# EAGLE design PCB2 (EAGLE 9.3.0)
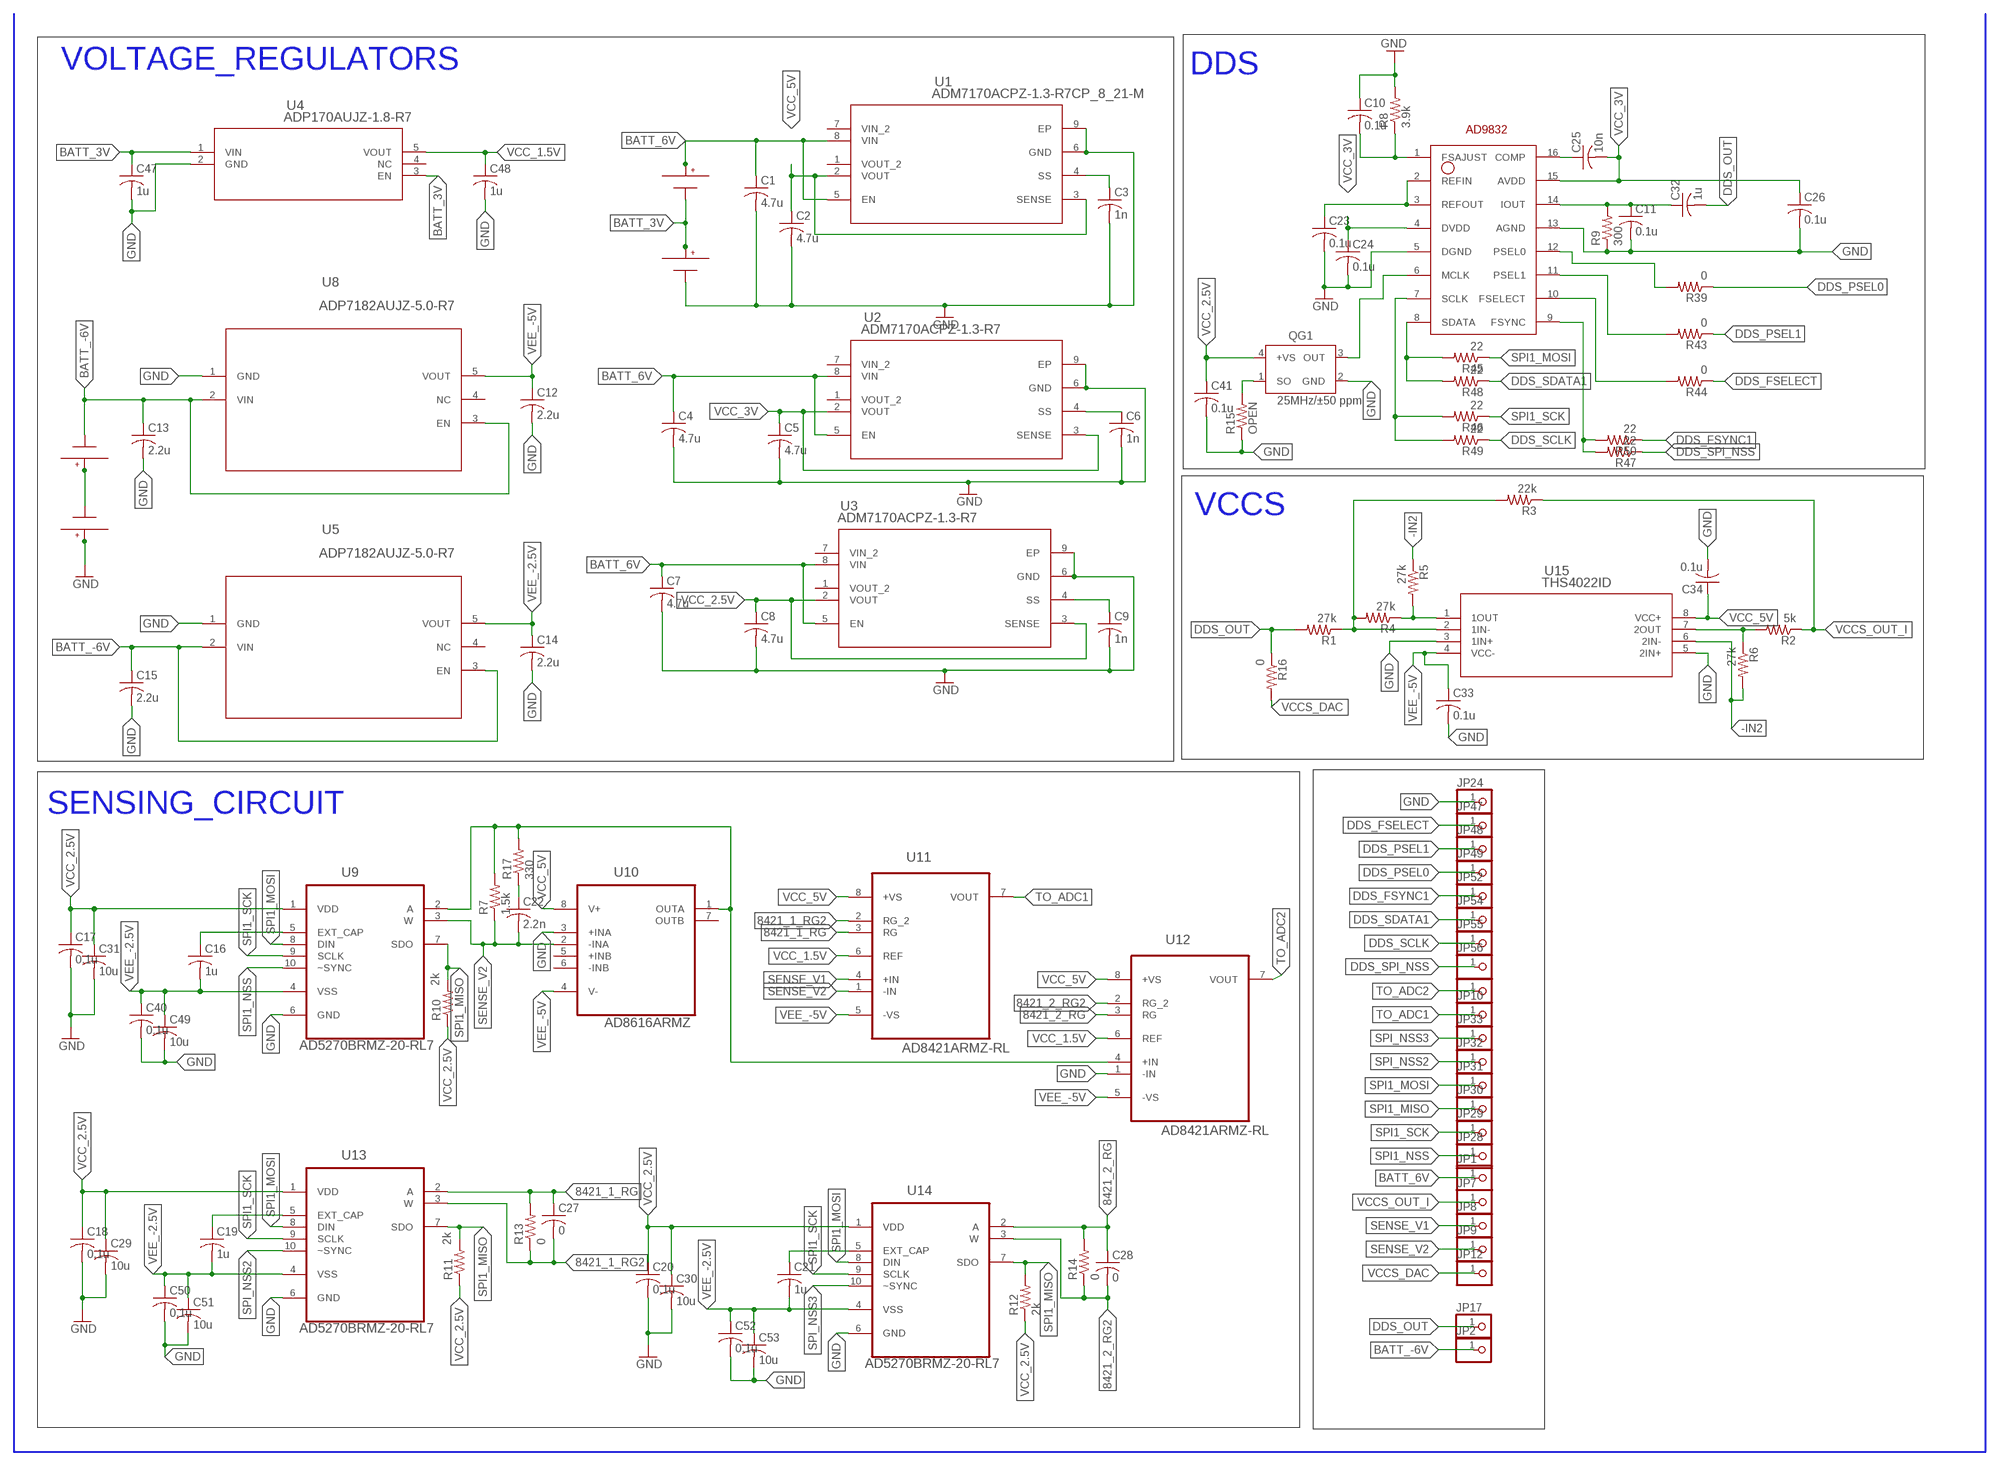
[diagram p0: schematic, sheet 1]

## Parts
C1  4.7u  C-USC0603  [C0603]
C2  4.7u  C-USC0603  [C0603]
C3  1n  C-USC0603  [C0603]
C4  4.7u  C-USC0603  [C0603]
C5  4.7u  C-USC0603  [C0603]
C6  1n  C-USC0603  [C0603]
C7  4.7u  C-USC0603  [C0603]
C8  4.7u  C-USC0603  [C0603]
C9  1n  C-USC0603  [C0603]
C10  0.1u  C-USC0603  [C0603]
C11  0.1u  C-USC0603  [C0603]
C12  2.2u  C-USC0603  [C0603]
C13  2.2u  C-USC0603  [C0603]
C14  2.2u  C-USC0603  [C0603]
C15  2.2u  C-USC0603  [C0603]
C16  1u  C-USC0603  [C0603]
C17  0.1u  C-USC0603  [C0603]
C18  0.1u  C-USC0603  [C0603]
C19  1u  C-USC0603  [C0603]
C20  0.1u  C-USC0603  [C0603]
C21  1u  C-USC0603  [C0603]
C22  2.2n  C-USC0603  [C0603]
C23  0.1u  C-USC0603  [C0603]
C24  0.1u  C-USC0603  [C0603]
C25  10n  C-USC0603  [C0603]
C26  0.1u  C-USC0603  [C0603]
C27  0  C-USC0603  [C0603]
C28  0  C-USC0603  [C0603]
C29  10u  C-USC0603  [C0603]
C30  10u  C-USC0603  [C0603]
C31  10u  C-USC0603  [C0603]
C32  1u  C-USC0603  [C0603]
C33  0.1u  C-USC0603  [C0603]
C34  0.1u  C-USC0603  [C0603]
C40  0.1u  C-USC0603  [C0603]
C41  0.1u  C-USC0603  [C0603]
C47  1u  C-USC0603  [C0603]
C48  1u  C-USC0603  [C0603]
C49  10u  C-USC0603  [C0603]
C50  0.1u  C-USC0603  [C0603]
C51  10u  C-USC0603  [C0603]
C52  0.1u  C-USC0603  [C0603]
C53  10u  C-USC0603  [C0603]
JP1  PINHD-1X1  [1X01]
JP2  PINHD-1X1  [1X01]
JP7  PINHD-1X1  [1X01]
JP8  PINHD-1X1  [1X01]
JP9  PINHD-1X1  [1X01]
JP10  PINHD-1X1  [1X01]
JP11  PINHD-1X1  [1X01]
JP12  PINHD-1X1  [1X01]
JP17  PINHD-1X1  [1X01]
JP24  PINHD-1X1  [1X01]
JP28  PINHD-1X1  [1X01]
JP29  PINHD-1X1  [1X01]
JP30  PINHD-1X1  [1X01]
JP31  PINHD-1X1  [1X01]
JP32  PINHD-1X1  [1X01]
JP33  PINHD-1X1  [1X01]
JP47  PINHD-1X1  [1X01]
JP48  PINHD-1X1  [1X01]
JP49  PINHD-1X1  [1X01]
JP52  PINHD-1X1  [1X01]
JP54  PINHD-1X1  [1X01]
JP55  PINHD-1X1  [1X01]
JP56  PINHD-1X1  [1X01]
QG1  25MHz/±50 ppm  WE-SPXO_IQXO-542_831056218  [WE-SPXO_IQXO-542]
R1  27k  R-US_R0603  [R0603]
R2  5k  R-US_R0603  [R0603]
R3  22k  R-US_R0603  [R0603]
R4  27k  R-US_R0603  [R0603]
R5  27k  R-US_R0603  [R0603]
R6  27k  R-US_R0603  [R0603]
R7  1.5k  R-US_R0603  [R0603]
R8  3.9k  R-US_R0603  [R0603]
R9  300  R-US_R0603  [R0603]
R10  2k  R-US_R0603  [R0603]
R11  2k  R-US_R0603  [R0603]
R12  2k  R-US_R0603  [R0603]
R13  0  R-US_R0603  [R0603]
R14  0  R-US_R0603  [R0603]
R15  OPEN  R-US_R0603  [R0603]
R16  0  R-US_R0603  [R0603]
R17  330  R-US_R0603  [R0603]
R39  0  R-US_R0603  [R0603]
R43  0  R-US_R0603  [R0603]
R44  0  R-US_R0603  [R0603]
R45  22  R-US_R0603  [R0603]
R46  22  R-US_R0603  [R0603]
R47  22  R-US_R0603  [R0603]
R48  22  R-US_R0603  [R0603]
R49  22  R-US_R0603  [R0603]
R50  22  R-US_R0603  [R0603]
U1  ADM7170ACPZ-1.3-R7CP_8_21-M  [CP_8_21-M]
U2  ADM7170ACPZ-1.3-R7  [CP_8_21]
U3  ADM7170ACPZ-1.3-R7  [CP_8_21]
U4  ADP170AUJZ-1.8-R7  [UJ_5]
U5  ADP7182AUJZ-5.0-R7  [UJ_5]
U8  ADP7182AUJZ-5.0-R7  [UJ_5]
U9  AD5270BRMZ-20-RL7  [SOP50P490X110-10N]
U10  AD8616ARMZ  [SOP65P490X110-8N]
U11  AD8421ARMZ-RL  [SOP65P490X110-8N]
U12  AD8421ARMZ-RL  [SOP65P490X110-8N]
U13  AD5270BRMZ-20-RL7  [SOP50P490X110-10N]
U14  AD5270BRMZ-20-RL7  [SOP50P490X110-10N]
U15  THS4022ID  [D8]
U$1  AD9832  [TSSOP16]
U$2  BAT-HLD-001  [BAT-HLD-001]
U$3  BAT-HLD-001  [BAT-HLD-001]
U$4  BAT-HLD-001  [BAT-HLD-001]
U$5  BAT-HLD-001  [BAT-HLD-001]

## Nets
8421_1_RG: C27.1 R13.2 U11.3(RG) U13.2(A)
8421_1_RG2: C27.2 R13.1 U11.2(RG_2) U13.3(W)
8421_2_RG: C28.1 R14.2 U12.3(RG) U14.2(A)
8421_2_RG2: C28.2 R14.1 U12.2(RG_2) U14.3(W)
-IN2: R5.1 R6.2 U15.6(2IN-)
BATT_3V: C47.1 U4.1(VIN) U4.3(EN) U$2.- U$3.+@1(+) U$3.+@2(+)
BATT_6V: C1.1 C4.1 C7.1 JP1.1 U1.5(EN) U1.8(VIN) U2.5(EN) U2.8(VIN) U3.5(EN) U3.8(VIN) U$2.+@1(+) U$2.+@2(+)
BATT_-6V: C13.1 C15.1 JP2.1 U5.2(VIN) U5.3(EN) U8.2(VIN) U8.3(EN) U$4.-
DDS_FSELECT: JP47.1 R44.1
DDS_FSYNC1: JP52.1 R50.1
DDS_OUT: C32.2 JP17.1 R1.2 R16.1
DDS_PSEL0: JP49.1 R39.1
DDS_PSEL1: JP48.1 R43.1
DDS_SCLK: JP55.1 R49.1
DDS_SDATA1: JP54.1 R48.1
DDS_SPI_NSS: JP56.1 R47.1
GND: C1.2 C2.2 C3.2 C4.2 C5.2 C6.2 C7.2 C8.2 C9.2 C10.1 C11.2 C12.2 C13.2 C14.2 C15.2 C17.2 C18.2 C20.2 C23.2 C24.2 C26.2 C29.2 C30.2 C31.2 C33.2 C34.2 C40.2 C41.2 C47.2 C48.2 C49.2 C50.2 C51.2 C52.2 C53.2 JP24.1 QG1.2(GND) R8.2 R9.1 R15.1 U1.6(GND) U1.9(EP) U2.6(GND) U2.9(EP) U3.6(GND) U3.9(EP) U4.2(GND) U5.1(GND) U8.1(GND) U9.6(GND) U10.3(+INA) U12.1(-IN) U13.6(GND) U14.6(GND) U15.3(1IN+) U15.5(2IN+) U$1.5(DGND) U$1.13(AGND) U$3.- U$5.+@1(+) U$5.+@2(+)
N$1: C11.1 C32.1 R9.2 U$1.14(IOUT)
N$2: C6.1 U2.4(SS)
N$3: R47.2 R50.2 U$1.9(FSYNC)
N$4: C3.1 U1.4(SS)
N$5: C22.1 R17.1
N$6: C16.1 U9.5(EXT_CAP)
N$7: R7.2 R17.2 U9.2(A) U10.1(OUTA) U12.4(+IN)
N$9: C9.1 U3.4(SS)
N$11: U$4.+@1(+) U$4.+@2(+) U$5.-
N$12: R45.2 R48.2 U$1.8(SDATA)
N$13: C19.1 U13.5(EXT_CAP)
N$14: C10.2 R8.1 U$1.1(FSAJUST)
N$15: C25.1 U$1.16(COMP)
N$16: C21.1 U14.5(EXT_CAP)
N$17: C23.1 U$1.2(REFIN) U$1.3(REFOUT)
N$18: QG1.1(SO) R15.2
N$19: R46.2 R49.2 U$1.7(SCLK)
N$23: R2.2 R6.1 U15.7(2OUT)
N$25: QG1.3(OUT) U$1.6(MCLK)
N$26: R4.1 R5.2 U15.1(1OUT)
N$27: R1.1 R3.2 R4.2 U15.2(1IN-)
N$52: R44.2 U$1.10(FSELECT)
N$53: R43.2 U$1.11(PSEL1)
N$56: R39.2 U$1.12(PSEL0)
SENSE_V1: JP8.1 U11.4(+IN)
SENSE_V2: C22.2 JP9.1 R7.1 U9.3(W) U10.2(-INA) U11.1(-IN)
SPI1_MISO: JP30.1 R10.2 R11.2 R12.2 U9.7(SDO) U13.7(SDO) U14.7(SDO)
SPI1_MOSI: JP31.1 R45.1 U9.8(DIN) U13.8(DIN) U14.8(DIN)
SPI1_NSS: JP28.1 U9.10(~SYNC)
SPI1_SCK: JP29.1 R46.1 U9.9(SCLK) U13.9(SCLK) U14.9(SCLK)
SPI_NSS2: JP32.1 U13.10(~SYNC)
SPI_NSS3: JP33.1 U14.10(~SYNC)
TO_ADC1: JP10.1 U11.7(VOUT)
TO_ADC2: JP11.1 U12.7(VOUT)
VCC_1.5V: C48.1 U4.5(VOUT) U11.6(REF) U12.6(REF)
VCC_2.5V: C8.1 C17.1 C18.1 C20.1 C29.1 C30.1 C31.1 C41.1 QG1.4(+VS) R10.1 R11.1 R12.1 U3.2(VOUT) U3.3(SENSE) U9.1(VDD) U13.1(VDD) U14.1(VDD)
VCC_3V: C5.1 C24.1 C25.2 C26.1 U2.2(VOUT) U2.3(SENSE) U$1.4(DVDD) U$1.15(AVDD)
VCC_5V: C2.1 C34.1 U1.2(VOUT) U1.3(SENSE) U10.8(V+) U11.8(+VS) U12.8(+VS) U15.8(VCC+)
VCCS_DAC: JP12.1 R16.2
VCCS_OUT_I: JP7.1 R2.1 R3.1
VEE_-2.5V: C14.1 C16.2 C19.2 C21.2 C40.1 C49.1 C50.1 C51.1 C52.1 C53.1 U5.5(VOUT) U9.4(VSS) U13.4(VSS) U14.4(VSS)
VEE_-5V: C12.1 C33.1 U8.5(VOUT) U10.4(V-) U11.5(-VS) U12.5(-VS) U15.4(VCC-)
Unconnected: U1.1(VOUT_2) U1.7(VIN_2) U2.1(VOUT_2) U2.7(VIN_2) U3.1(VOUT_2) U3.7(VIN_2) U4.4(NC) U5.4(NC) U8.4(NC) U10.5(+INB) U10.6(-INB) U10.7(OUTB)

## Notes on the sheet
- VOLTAGE_REGULATORS | DDS
- VCCS
- SENSING_CIRCUIT

## Library data of the parts
C1-C34 C40 C41 C47-C53 = adafruit:C-US: CAPACITOR, American symbol
JP1 JP7-JP12 JP24 JP28-JP33 JP47-JP49 JP52 JP54-JP56 = adafruit:PINHD-1X1: Pin header 1x1 for 0.1" spacing With round pins
JP2 JP17 = adafruit:PINHD-1X1: Pin header 1x1 for 0.1" spacing With round pins; SPICEPREFIX: X
QG1 = Crystal25MHz:WE-SPXO_IQXO-542: WE-SPXO Simple Packaged Quartz Oscillator <https://katalog.we-online.com/media/images/v2/o135918v209%20Family_WE-SPXO.jpg> Details see: https://katalog.we-online.com/en/pbs/WE-SPXO Created by Yingchun Shan,2018-11-19 2018 (C) Wurth Elektronik; WE-NUMBER: 831056218
R1-R17 R39 R43-R50 = adafruit:R-US_: RESISTOR, American symbol
U1-U3 = ADM7170:ADM7170ACPZ-1.3-R7; MANUFACTURER_PART_NUMBER: ADM7170ACPZ1.3R7; VENDOR: Analog Devices Inc
U4 = ADP170:ADP170AUJZ-1.8-R7; MANUFACTURER_PART_NUMBER: ADP170AUJZ1.8R7; VENDOR: Analog Devices Inc
U5 U8 = ADP7182:ADP7182AUJZ-5.0-R7; MANUFACTURER_PART_NUMBER: ADP7182AUJZ5.0R7; VENDOR: Analog Devices Inc
U9 U13 U14 = AD5270BRMZ-20-RL7:AD5270BRMZ-20-RL7: Digital Rheostat; AVAILABILITY: Unavailable; DESCRIPTION: Digital Potentiometer 1024POS 20KOhm Single 10-Pin MSOP T/R; MF: Analog Devices; MP: AD5270BRMZ-20-RL7; PACKAGE: TFSOP-10 Analog Devices; PRICE: None
U10 = AD8616ARMZ:AD8616ARMZ: Input/Output Operational Amplifiers; AVAILABILITY: Unavailable; DESCRIPTION: IC, Operational Amplifier, DUAL, CMOS, TSSOP, 8PIN, PLASTIC; MF: Analog Devices; MP: AD8616ARMZ-REEL; PACKAGE: MSOP-8 Analog Devices; PRICE: None
U11 U12 = AD8421ARMZ-RL:AD8421ARMZ-RL: Instrumentation Amplifier; AVAILABILITY: Unavailable; DESCRIPTION: Amplifier - Special Purpose; MF: Analog Devices; MP: AD8421ARMZ-RL; PACKAGE: MSOP-8 Analog Devices; PRICE: None
U15 = THS4022:THS4022ID; MANUFACTURER_PART_NUMBER: THS4022ID; VENDOR: Texas Instruments
U$1 = AD9832:AD9832: The AD9832 is a numerically controlled oscillator employing a phase accumulator, a sine look-up table and a 10-bit D/A converter integrated on a single CMOS chip. Modulation capabilities are provided for phase modulation and frequency modulation. Clock rates up to 25 MHz are supported. Frequency accuracy can be controlled to one part in 4 billion. Modulation is effected by loading registers through the serial interface. A power-down bit allows the user to power down the AD9832 when it is not in use, the power consumption being reduced to 5 mW (5 V) or 3 mW (3 V). The part is available in a 16-lead TSSOP package.; AVAILABILITY: Unavailable; DESCRIPTION: ADI 10-BIT D/A CONVERTER ON A SINGL.CHIP IC.; MF: Analog Devices; MP: AD9832; PACKAGE: None; PRICE: None
U$2-U$5 = BAT-HLD-001:BAT-HLD-001: Linx Technologies BAT-HLD-001 surface mount CR2032 single-cell holder digikey: BAT-HLD-001-ND; AVAILABILITY: Unavailable; DESCRIPTION: CR2032 Phosphor Bronze / Nickel Plated 20 mm Cell Size Battery Holder; MF: Linx Technologies; MP: BAT-HLD-001; PACKAGE: None; PRICE: None

## Net classes
0 default: width 0.203 mm

## Board
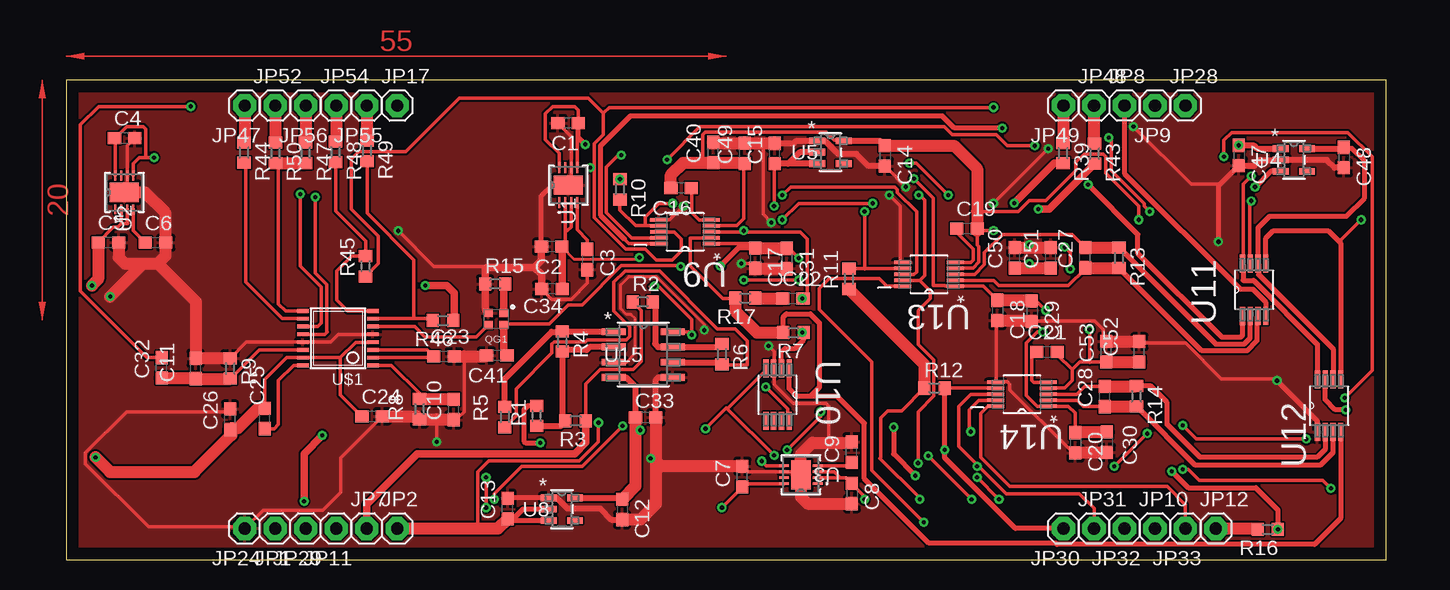
[diagram p1: board, top side]
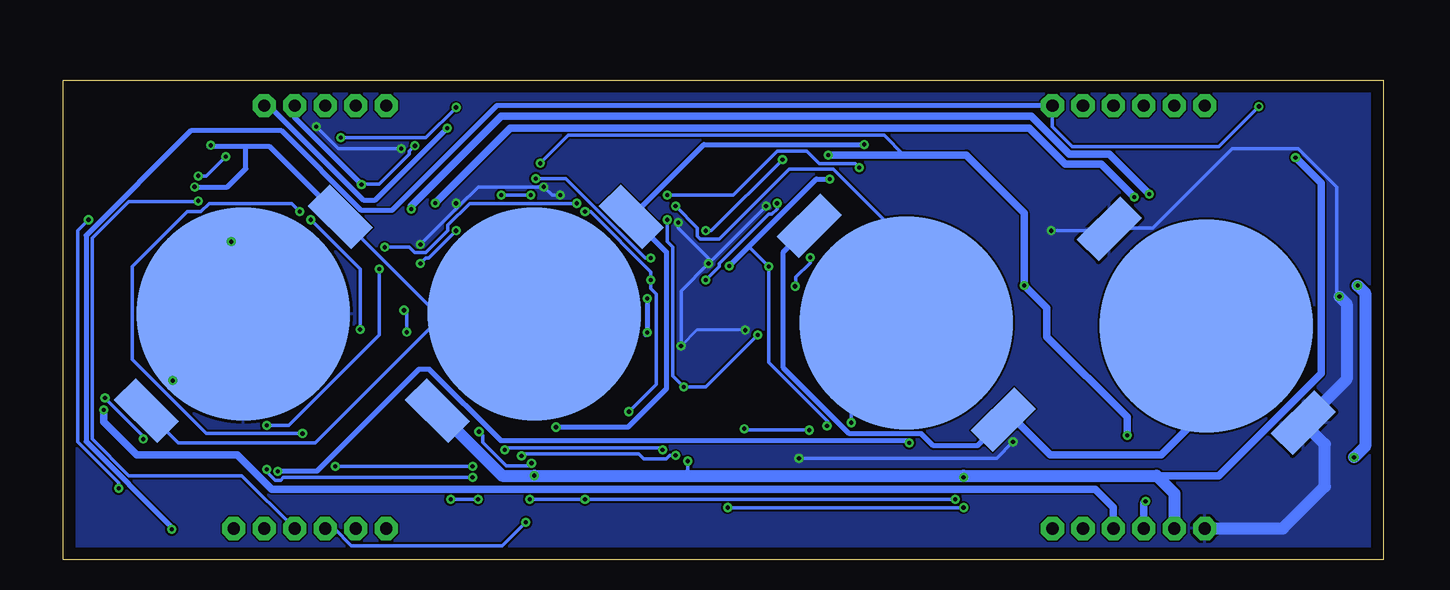
[diagram p2: board, bottom side, seen from below]

Size 110 x 40 mm. Coordinates in mm from the lower left corner, seen from the top.
Outline: 0,0 110,0 110,40 0,40 0,0
Copper layers (1*16): Top 0.035mm / dielectric 1.5mm / Bottom 0.035mm
Design rules "default": minimum track width 6mil, minimum drill 0.35mm, track to track 6mil, track to pad 6mil, pad to pad 6mil, via to via 6mil, smd to smd 6mil, copper to edge 40mil, drill to drill 6mil, minimum pad ring 10mil, minimum via ring 8mil, stop-mask expansion 4mil, vias tented up to drill 0mil, thermal gap 10mil

### Footprints (pad centres in the part's own frame; a part is rotated, then mirrored left to right if it is on the bottom)
C0603 = smd 1.1 x 1: 1 -0.85,0; 2 0.85,0
1X01 = drill 1.016 pad 1.93 octagon: 1 0,0
WE-SPXO_IQXO-542 = smd 0.75 x 0.65: 1 -0.65,-0.5; 2 0.65,-0.5; 3 0.65,0.5; 4 -0.65,0.5
R0603 = smd 1 x 1.1: 1 -0.85,0; 2 0.85,0
CP_8_21-M = smd 0.906 x 0.198: 1 -1.453,0.75; 2 -1.453,0.25; 3 -1.453,-0.25; 4 -1.453,-0.75; 5 1.453,-0.75; 6 1.453,-0.25; 7 1.453,0.25; 8 1.453,0.75 | smd 1.6 x 2.44: 9 0,0
CP_8_21 = smd 0.805 x 0.198: 1 -1.402,0.75; 2 -1.402,0.25; 3 -1.402,-0.25; 4 -1.402,-0.75; 5 1.402,-0.75; 6 1.402,-0.25; 7 1.402,0.25; 8 1.402,0.75 | smd 1.6 x 2.44: 9 0,0
UJ_5 = smd 1.321 x 0.559: 1 -1.092,0.95; 2 -1.092,0; 3 -1.092,-0.95; 4 1.092,-0.95; 5 1.092,0.95
SOP50P490X110-10N = smd 1.422 x 0.305: 1 -2.184,0.991; 2 -2.184,0.508; 3 -2.184,0; 4 -2.184,-0.508; 5 -2.184,-0.991; 6 2.184,-0.991; 7 2.184,-0.508; 8 2.184,0; 9 2.184,0.508; 10 2.184,0.991
SOP65P490X110-8N = smd 1.499 x 0.432: 1 -2.184,0.965; 2 -2.184,0.33; 3 -2.184,-0.33; 4 -2.184,-0.965; 5 2.184,-0.965; 6 2.184,-0.33; 7 2.184,0.33; 8 2.184,0.965
D8 = smd 1.981 x 0.559: 1 -2.464,1.905; 2 -2.464,0.635; 3 -2.464,-0.635; 4 -2.464,-1.905; 5 2.464,-1.905; 6 2.464,-0.635; 7 2.464,0.635; 8 2.464,1.905
TSSOP16 = smd 0.305 x 0.991: 1 -2.275,-2.918; 2 -1.625,-2.918; 3 -0.975,-2.918; 4 -0.325,-2.918; 5 0.325,-2.918; 6 0.975,-2.918; 7 1.625,-2.918; 8 2.275,-2.918; 9 2.275,2.918; 10 1.625,2.918; 11 0.975,2.918; 12 0.325,2.918; 13 -0.325,2.918; 14 -0.975,2.918; 15 -1.625,2.918; 16 -2.275,2.918
BAT-HLD-001 = smd 2.54 x 5.08: +@1 -11.43,0; +@2 11.43,0 | smd 17.78 x 17.78: - 0,0

### Placement (x,y rotation side)
C1  41.82,36.41 180 top
C2  40.45,26.1 180 top
C3  43.43,25.03 270 top
C4  4.86,35.17 0 top
C5  3.51,26.46 0 top
C6  7.43,26.43 0 top
C7  56.35,6.93 90 top
C8  65.47,5.53 270 top
C9  65.44,8.97 90 top
C10  32.28,12.52 90 top
C11  10.79,15.94 90 top
C12  46.32,4.19 270 top
C13  36.78,4.27 90 top
C14  68.22,33.67 270 top
C15  59.03,33.87 90 top
C16  51.24,30.99 180 top
C17  57.41,25.14 270 top
C18  77.59,20.79 270 top
C19  75.06,27.62 0 top
C20  84.09,9.74 270 top
C21  81.72,17.34 0 top
C22  60.55,21.79 0 top
C23  31.47,16.96 0 top
C24  25.49,11.96 0 top
C25  16.54,11.77 90 top
C26  13.65,11.71 90 top
C27  84.9,25.19 90 top
C28  86.54,13.61 90 top
C29  80.46,20.72 270 top
C30  86.71,9.8 270 top
C31  60.04,25.11 270 top
C32  7.94,15.99 90 top
C33  48.28,11.88 0 top
C34  40.47,22.57 180 top
C40  53.91,33.95 90 top
C41  35.88,17.04 180 top
C47  97.71,33.71 270 top
C48  106.46,33.54 270 top
C49  56.54,33.88 90 top
C50  79.04,25.17 90 top
C51  82.04,25.18 90 top
C52  89.42,17.34 90 top
C53  86.67,17.34 90 top
JP1  17.41,2.6 180 top
JP2  27.57,2.6 0 top
JP7  25.03,2.6 0 top
JP8  88.18,37.88 0 top
JP9  90.72,37.88 180 top
JP10  90.72,2.6 0 top
JP11  22.49,2.6 180 top
JP12  95.8,2.6 0 top
JP17  27.57,37.88 0 top
JP24  14.87,2.6 180 top
JP28  93.26,37.88 0 top
JP29  19.95,2.6 180 top
JP30  83.1,2.6 180 top
JP31  85.64,2.6 0 top
JP32  88.18,2.6 180 top
JP33  93.26,2.6 180 top
JP47  14.87,37.88 180 top
JP48  85.64,37.88 0 top
JP49  83.1,37.88 180 top
JP52  17.41,37.88 0 top
JP54  22.49,37.88 0 top
JP55  25.03,37.88 180 top
JP56  19.95,37.88 180 top
QG1  35.81,20.08 180 top
R1  39.2,11.99 90 top
R2  48.04,21.5 0 top
R3  42.45,11.58 180 top
R4  41.33,18.2 270 top
R5  36.54,11.9 90 top
R6  54.64,17.14 270 top
R7  60.6,18.94 180 top
R8  29.43,12.55 270 top
R9  13.66,15.95 270 top
R10  46.13,30.89 270 top
R11  65.22,23.43 90 top
R12  72.34,14.31 0 top
R13  87.73,25.18 270 top
R14  89.19,13.62 270 top
R15  35.75,23 0 top
R16  100.12,2.52 180 top
R17  56.58,21.82 180 top
R39  83.06,33.91 270 top
R43  85.69,33.87 270 top
R44  14.81,33.95 270 top
R45  24.94,24.48 90 top
R46  31.39,19.94 180 top
R47  19.93,33.94 270 top
R48  22.43,34.02 270 top
R49  25.06,34.09 270 top
R50  17.43,33.92 270 top
U1  41.83,31.23 90 top
U2  4.83,30.63 90 top
U3  61.22,7.08 180 top
U4  102.3,33.34 0 top
U5  63.69,33.98 0 top
U8  41.3,4.21 0 top
U9  51.57,27.34 180 top
U10  59.27,13.75 270 top
U11  98.98,22.51 90 top
U12  105.23,12.84 90 top
U13  71.89,23.8 180 top
U14  79.64,13.8 180 top
U15  48.08,17.1 0 top
U$1  22.64,18.47 90 top
U$2  70.75,20.5 45 bottom
U$3  95,20.5 45 bottom
U$4  39.75,19.75 315 bottom
U$5  14.75,19.5 315 bottom

### Tracks (layer width: path | path; a pad name or v marks a point on that pad's centre or on a via)
8421_1_RG
  Top 0.305: U13.2 77.29,23.29 77.72,22.86 83.52,22.86 84.9,24.25 C27.1
  Top 0.406: U11.3 99.22,20.24 99.22,18.27 98.38,17.42 94.64,17.42 87.72,24.34
  Top 1.016: C27.1 87.72,24.34 R13.2
8421_1_RG2
  Top 0.305: U13.3 75.69,23.8 76.5,24.61 76.5,25.6 78.03,27.13 83.82,27.13 C27.2
  Top 0.406: R13.1 95.78,17.98 98.15,17.98 98.65,18.49 U11.2
  Top 1.016: C27.2 87.72,26.04 R13.1
8421_2_RG
  Top 0.305: U14.2 84.24,13.29 84.76,12.78 86.56,12.78
  Top 0.406: R14.2 94.03,7.92 104.55,7.92 105.56,8.94 U12.3
  Top 1.016: C28.1 86.56,12.78 R14.2
8421_2_RG2
  Top 0.305: U14.3 84.21,13.8 84.87,14.46 C28.2
  Top 0.406: U12.2 104.9,9.19 104.24,8.53 94.49,8.53 91.75,11.28 91.75,13.11 90.38,14.47 R14.1
  Top 1.016: C28.2 89.17,14.46 R14.1
-IN2
  Top 0.305: R5.1 37.5,12.01 37.5,14.25 40.48,17.23 40.48,17.98 40.65,18.16 43.25,18.16 43.41,18.32 46.66,18.32 46.97,18.63 46.97,19.39 45.64,20.72 45.64,23.14 46.56,24.06 49.44,24.06 54.25,19.25 55.75,19.25 56.75,18.25 56.75,16.25 54.68,16.25 R6.2
  Top 0.508: U15.6 54.47,16.46 R6.2
BATT_3V  (via drill 0.35)
  Top 0.406: U4.3 100.36,32.39 v99.06,31.09
  Top 0.508: C47.1 98.94,34.56 99.21,34.29 U4.1
  Bottom 0.305: U$3.+@2 78.84,20.5 U$2.- 78.25,20.5 89,9.75 100.41,9.75 U$3.+@1
  Bottom 0.406: U$3.+@2 92.78,34.44 94.79,34.44 | 94.79,34.44 97.83,34.44 | 97.84,34.44 97.83,34.44 | 97.83,34.44 C47.1 | v99.06,31.09 96.32,31.09 94.79,32.61 94.79,34.44
  other vias: 97.71,34.56
BATT_6V  (via drill 0.35)
  Top 0.305: U2.8 4.08,35.1 C4.1 4.12,35.2 5.03,36.12 6.4,36.12 6.63,35.89 6.63,33.53 | U1.5 42.58,36.32 C1.1 42.67,37.49 42.37,37.8 40.54,37.8 39.93,37.19 39.93,35.05 41.08,33.9 U1.8 | U3.8 56.59,6.33 C7.1 56.24,5.94 v54.63,4.34 | v7.32,33.53 6.63,33.53 | 6.63,33.53 6.1,33.53 5.58,33.01 U2.5 | v34.98,4.34 v34.98,6.86 | U3.5 58.35,7.83 v57.96,8.22
  Top 0.406: v68.94,11.05 68.94,8.81 v70.75,7 v70.75,7.01 | v43.25,34.63 42.67,35.21 C1.1
  Bottom 0.305: v54.63,4.34 v34.98,4.34 | v34.98,6.86 34.98,7.01 | v57.96,8.22 57.96,7.07 58.02,7.01
  Bottom 0.406: v68.94,11.05 62.95,11.05 59.75,14.25 59.75,25.66 U$2.+@2 56.62,34.63 v43.25,34.63
  Bottom 0.61: 18.9,7.01 13.72,7.01 5.18,15.54 5.18,31.39 v7.32,33.53
  Bottom 1.016: U$2.+@1 73.42,7.01 v70.75,7.01 58.02,7.01 34.98,7.01 18.9,7.01 17.41,5.52 JP1.1
BATT_-6V  (via drill 0.35)
  Top 0.305: v58.98,29.49 58.98,32.92 C15.1 | 34.29,2.6 34.29,7.32 35.2,8.23 42.75,8.23 44.35,9.83 v44.35,11.43
  Top 0.406: U8.2 38.04,4.21 37.25,3.42 C13.1 36.94,3.26 U8.3
  Top 0.508: U5.2 61.11,33.98 60.16,33.03 | C15.1 60.15,33.02 60.16,33.03 | U5.3 60.16,33.03
  Top 1.016: JP2.1 34.29,2.6 35.96,2.6 C13.1
  Bottom 0.305: v58.98,29.49 57.15,27.66 57.15,26.98 56.92,26.75 55.32,26.75 49.49,32.58 45.84,32.58 39.78,26.52 39.78,19.89 U$4.- 39.78,19.66 44.35,15.09 v44.35,11.43
DDS_FSELECT
  Top 1.016: JP47.1 14.87,34.85 R44.1
DDS_FSYNC1
  Top 1.016: JP52.1 17.41,34.8 R50.1
DDS_OUT  (via drill 0.35)
  Top 0.305: C32.2 6.72,16.84 1.17,22.4 1.17,36.27 2.69,37.8 v10.36,37.8
  Top 0.406: R1.2 38.47,12.84 38.12,12.5 38.12,9.88 38.25,9.75 v39.5,9.75 | v92.12,7.38 93.5,6 99.12,6 100.97,4.16 R16.1
  Bottom 0.305: v10.36,37.8 13.72,34.44 25.91,34.44 27.57,36.1 JP17.1
  Bottom 0.406: v39.5,9.75 39.68,9.93 73.56,9.93 79.5,15.88 80.38,15.88 88.88,7.38 v92.12,7.38 | JP17.1 73.88,37.88 82.62,29.12 85.16,29.12 91.81,35.77 99.36,35.77 108.1,27.03 108.1,9.85 101,2.75 101,2.62 100.97,2.6 R16.1
  other vias: 100.97,2.52
DDS_PSEL0
  Top 1.016: JP49.1 83.1,34.8 R39.1
DDS_PSEL1
  Top 1.016: JP48.1 85.64,34.76 R43.1
DDS_SCLK
  Top 1.016: JP55.1 25.03,34.98 R49.1
DDS_SDATA1
  Top 1.016: JP54.1 22.49,34.92 R48.1
DDS_SPI_NSS
  Top 1.016: JP56.1 19.95,34.8 R47.1
GND  (via drill 0.35)
  Top 0.254: U15.3 46.65,16.46 47.4,17.22 47.4,19.57 47.4,20.1 47.04,20.46 46.68,20.46 46.2,20.94 46.2,22.92 46.91,23.63 47.88,23.63 48.06,23.63 49.15,23.63 53.16,19.62 v53.16,19.14
  Top 0.305: C4.2 5.08,34.54 U2.6 5.08,30.88 U2.9 | R9.1 15.01,18.14 U$1.13 22.02,18.14 22.67,18.8 U$1.5 | U1.9 42.06,31.46 42.06,32.67 U1.6 42.08,35.3 C1.2 | C7.2 56.8,7.33 U3.6 60.97,7.33 U3.9 | C24.2 22.88,8.49 22.88,5.62 21.38,4.12 16.39,4.12 JP24.1 14.86,2.74 6.86,2.74 1.6,8 1.6,8.91 5.03,12.34 13.49,12.34 C26.2 | C3.2 43.41,24.16 43.41,23.07 42.06,21.72 40.46,21.72 39.78,22.4 C34.2 | v27.66,27.43 30.63,24.46 34.75,24.46 34.9,24.23 | 33.15,16.96 33.15,12.34 32.69,11.89 C10.1 | 77.5,14.86 77.5,19.66 C18.2 | 77.5,14.86 78.41,14.86 78.64,14.63 78.64,14.17 83.67,9.14 C20.2 | 77.5,14.86 U14.6 | C53.2 86.41,18.52 86.41,19.2 85.72,19.89 80.92,19.89 C29.2 | C52.2 89.84,18.06 93.27,18.06 96.24,15.09 100.81,15.09 v100.89,14.94 | v68.58,30.4 69.49,29.49 69.49,24.92 U13.6 | v69.95,31.09 68.35,32.69 C14.2 | v80.24,26.29 80.24,26.02 | 63.55,9.75 63.55,12.8 63.32,13.03 60.58,13.03 58.98,14.63 58.98,15.77 U10.3 58.98,16 58.98,17.37 v58.52,17.83 | v51.44,29.49 50.29,28.35 49.61,28.35 U9.6 | v56.24,24.69 57.15,24.69 C17.2 | 58.06,34.73 58.06,28.8 v58.75,28.12 | v88.92,36.12 93.73,31.32 96.01,31.32 96.01,31.16 | v77.27,29.72 v81.84,34.29 | v30.86,9.83 30.86,11.71 | v48.69,8.46 49.13,8.23
  Top 0.406: U8.1 36.82,5.16 C13.2 | C47.2 96.01,31.16 v96.01,26.52 | U12.1 104.27,11.56 v100.89,14.94 | C2.2 39.59,30.34 40.5,31.25 40.52,31.23 U1.9
  Top 0.508: C15.2 60.63,34.72 60.84,34.94 U5.1 63.21,34.94 64.31,33.83 65.84,33.83 66.84,32.83 C14.2 | C47.2 99,32.86 99.48,33.34 U4.2 105.04,33.34 105.69,32.69 C48.2 | U8.1 40.87,5.16 41.76,4.27 44.5,4.27 45.43,3.34 C12.2 | C33.2 49.13,14.99 49.38,15.24 49.42,15.2 U15.5
  Top 0.61: QG1.2 34.9,20.84 R15.1 34.9,24.23 35.05,24.38 39.01,24.38 | 39.01,24.38 39.62,23.77 C34.2 | C2.2 39.59,24.96 39.01,24.38
  Top 1.016: C5.2 4.36,25.21 4.88,24.69 6.4,24.69 | 6.4,24.69 7.62,24.69 | 7.62,24.69 8.28,25.35 C6.2 8.28,28.91 6.56,30.63 U2.9 | R9.1 C11.2 | C11.2 | C10.1 32.25,11.71 30.86,11.71 R8.2 29.18,11.96 C24.2 | C23.2 33.15,16.96 34.95,16.96 C41.2 | C40.2 53.99,34.73 C49.2 58.06,34.73 C15.2 | C9.2 65.37,9.75 63.55,9.75 62.18,9.75 61.22,8.79 U3.9 61.22,5.23 61.77,4.67 C8.2 | C17.2 60.01,24.3 C31.2 | C50.2 80.24,26.02 C51.2 | C18.2 80.39,19.94 C29.2 | C53.2 C52.2 | C20.2 84.14,8.95 C30.2 | 7.62,24.69 10.79,21.52 C11.2 | 6.4,24.69 v3.66,21.95 | C33.2 49.13,8.23 | 49.13,8.23 49.13,4.63 47.84,3.34 C12.2 | C7.2 49.58,7.78 49.13,8.23
  Bottom 0.254: v53.16,19.14 57.21,19.14 v58.52,17.83
  Bottom 0.305: v27.66,27.43 22.86,27.43 U$5.+@1 22.63,27.66 19.2,27.66 12.57,34.29 7.09,34.29 3.89,31.09 3.89,22.4 v3.66,21.95 | v68.58,30.4 69.27,30.4 v69.95,31.09 75.44,31.09 77.04,29.49 | 77.04,29.49 v80.24,26.29 | 56.01,24.92 v51.44,29.49 | v58.52,17.83 58.52,22.4 v56.24,24.69 56.01,24.92 | v58.75,28.12 58.75,27.66 56.01,24.92 | v88.92,36.12 87.1,34.29 v81.84,34.29 | 77.04,29.49 v77.27,29.72 | v30.86,9.83 32.23,8.46 v48.69,8.46
  Bottom 0.406: v96.01,26.52 95,25.51 U$3.- 95.32,20.5 v100.89,14.94
  Bottom 1.016: JP24.1 8.37,2.6 4.88,6.1 4.88,9.63 U$5.+@2 3.05,15.04 3.05,21.34 v3.66,21.95
  pour Bottom: -1,41 -1,-1 111,-1 111,41
  pour Top: -1,41 -1,-1 111,-1 111,41
N$1
  Top 0.305: U$1.14 16.06,17.5 R9.2
  Top 1.016: C32.1 10.73,15.14 C11.1 R9.2
N$2
  Top 0.305: U2.4 5.58,27.43 C6.1
N$3
  Top 0.305: U$1.9 19.7,20.73 18.29,20.73 17.68,21.34 17.68,32.83 R50.2
  Top 1.016: R50.2 19.93,33.08 R47.2
N$4
  Top 0.305: U1.4 42.58,27.52 43.43,26.67 C3.1
N$5
  Top 1.016: R17.1 57.45,21.79 C22.1
N$6
  Top 0.305: C16.1 52.12,30.96 52.12,28.96 52.74,28.33 U9.5
N$7
  Top 0.305: U9.2 52,26.84 52,24.5 54.7,21.8 55.75,21.8
  Top 0.406: U12.4 106.19,3.44 104.03,1.28 82.55,1.28 82.46,1.38 71.88,1.38 66.5,6.75 66.5,11.38 64.25,13.62 62,13.62 | 62,13.62 60.88,13.62 60.23,14.27 U10.1 | R7.2 59.75,20.25 60,20.5 62,20.5 62.75,19.75 62.75,14.38 62,13.62
  Top 1.016: R17.2 55.75,21.8 55.75,20.75 57.56,18.94 R7.2
N$9
  Top 0.305: U3.4 65.14,7.83 C9.1
N$11
  Bottom 0.406: U$4.+@2 33.84,9.5 37.5,9.5 38.5,10.5 44.5,10.5 50,16 50,25.66 U$4.+@1
  Bottom 0.61: U$5.- 14.75,12.5 18.5,8.75 27.75,8.75 30.67,11.67 U$4.+@2
N$12
  Top 0.305: R48.2 22.43,29.08 24.94,26.57 R45.2 23.8,25.32 22.55,24.08 22.55,21.64 23.47,20.73 23.49,20.75 U$1.8
N$13
  Top 0.305: C19.1 74.21,27.29 75.59,25.91 75.59,24.99 75.39,24.79 U13.5
N$14
  Top 0.305: U$1.1 27.09,16.2 29.43,13.85 R8.1
  Top 1.016: R8.1 32.25,13.4 C10.2
N$15
  Top 0.305: U$1.16 18.94,16.2 17.68,14.94 17.68,11.28 17.32,10.92 C25.1
N$16
  Top 0.305: U14.5 80.61,14.79 80.47,14.94 80.47,16.93 C21.1
N$17
  Top 0.305: U$1.2 30.5,16.84 C23.1 30.09,17.5 U$1.3
N$18
  Top 0.61: QG1.1 36.47,22.86 R15.2
N$19
  Top 0.305: U$1.7 28.96,20.09 | 28.96,20.09 30.39,20.09 R46.2 | R49.2 25.06,28.89 28.96,24.99 28.96,20.09
N$23
  Top 0.508: R6.1 54.38,17.73 U15.7 49.32,17.73 49.06,17.99 49.06,21.32 R2.2
N$25
  Top 0.305: U$1.6 29.02,19.45 29.87,18.59 34.18,18.59 QG1.3
N$26
  Top 0.508: U15.1 41.38,19 | 41.38,19 R4.1 | R5.2 36.54,15.09 40.45,19 41.38,19
N$27
  Top 0.508: R1.1 41.16,11.14 R3.2 41.33,11.85 R4.2 41.47,17.48 43.37,17.48 43.62,17.73 U15.2
N$52
  Top 0.305: U$1.10 18,20.09 14.94,23.16 14.94,32.97 R44.2
N$53  (via drill 0.35)
  Top 0.305: U$1.11 20.95,19.45 21.25,19.75 21.25,22.75 19.5,24.5 v19.5,30.5
  Top 0.61: v81,29.25 81.92,29.25 R43.2
  Bottom 0.61: v19.5,30.5 22.83,33.83 26.16,33.83 29.33,37 73.5,37 81,29.5 v81,29.25
N$56  (via drill 0.35)
  Top 0.305: v20.75,30.25 20.75,23.9 21.71,22.94 21.71,19.04 21.75,19 21.55,18.8 U$1.12
  Top 0.61: R39.2 82.31,33.06 v79,29.75
  Bottom 0.61: v79,29.75 72.75,36 29.5,36 26.5,33 23.5,33 v20.75,30.25
SENSE_V1
  Top 0.406: JP8.1 88.18,32.22 97.84,22.55 98.88,22.55 99.94,21.49 U11.4
SENSE_V2  (via drill 0.35)
  Top 0.305: U9.3 56.46,27.34 | 56.46,27.34 61.16,27.34 61.75,26.75 61.75,22.14 C22.2 | v50.06,33.38 52.81,36.12 73.15,36.12 73.84,35.43 77.5,35.43 78.41,34.52 v80.7,34.52 | v56.46,27.43 56.46,27.34
  Top 0.406: U11.1 98.02,18.72 97.84,18.54 96.32,18.54 89.31,25.55 89.31,27.13 v85.15,31.29 | U10.2 59.6,17.35 59.88,17.62 60.75,17.62 61.45,18.32 R7.1 v61.33,18.94 | C22.2 v61.33,21.79
  Bottom 0.305: v56.46,27.43 56.01,27.43 v50.06,33.38 | v80.7,34.52 81.15,34.06 81.15,33.83 83.67,31.32 85.04,31.32 v85.15,31.29
  Bottom 0.406: v85.15,31.29 90.72,36.86 JP9.1 | v61.33,21.79 v61.33,18.94 61.33,18.92 61.5,18.75
SPI1_MISO  (via drill 0.35)
  Top 0.305: U9.7 48.23,27.85 | 48.23,27.85 47.44,27.85 46.13,29.15 R10.2 | R11.2 66.52,24.28 | 66.52,24.28 69.68,24.28 U13.7 | U14.7 77.44,14.33 73.21,14.33 R12.2 | v66.52,29.03 66.52,24.28 | v56.46,23.32 v61.04,23.32 | v50.52,29.72 49.38,29.72 48.23,28.57 48.23,27.85 | 66.52,24.23 66.52,24.28 | v62.87,12.34 62.87,11.96 v60.06,9.15 | v73.21,9.15 73.19,9.15
  Top 0.406: JP30.1 79.09,2.6 73.19,8.49 73.19,9.15 R12.2
  Bottom 0.305: v66.52,29.03 66.06,29.03 61.04,24 v61.04,23.32 61.04,22.63 60.58,22.17 60.58,14.63 v62.87,12.34 | v56.46,23.32 55.32,24.46 55.32,24.69 51.21,28.8 50.98,28.8 50.52,29.26 v50.52,29.72 | v73.21,9.15 73.03,9.34 60.24,9.34 v60.06,9.15
SPI1_MOSI  (via drill 0.35)
  Top 0.305: JP31.1 85.65,4.27 84.43,5.49 78.33,5.49 75.97,7.85 | U14.8 75.37,13.8 74.37,12.8 74.37,9.45 75.97,7.85 | R45.1 26,24.68 26,27 23.75,29.25 23.75,33.42 24.38,34.05 28.3,34.05 32.75,38.5 43.5,38.5 44.75,37.25 | 43.99,32.69 43.99,34.71 44.75,35.47 44.75,37.25 | 43.99,32.69 43.99,28.54 46.61,25.92 48.25,25.92 49.17,25 50.5,25 51.25,25.75 51.25,26.75 50.66,27.34 U9.8 | v59.66,30.4 60.35,31.09 69.04,31.09 69.27,30.86 69.27,30.63 70.87,29.03 70.87,24 70.64,23.77 69.72,23.77 U13.8 | 43.99,32.69 v43.66,32.69 | v90.07,10.52 v87.33,7.77 | v90.3,29.03 89.84,29.49 89.84,29.72 87.1,32.46 87.1,34.98 v86.87,35.2 | v77.27,37.72 45.26,37.72 44.81,37.26 44.75,37.25 | v75.89,7.77 75.97,7.85
  Bottom 0.305: v59.66,30.4 54.18,30.4 50.52,34.06 48.03,34.06 47.01,33.04 44.01,33.04 v43.66,32.69 | v87.33,7.77 v75.89,7.77 | v90.07,10.52 98.07,10.52 104.24,16.69 104.24,24.46 99.67,29.03 98.53,29.03 97.84,29.72 90.98,29.72 v90.3,29.03 | v86.87,35.2 79.78,35.2 v77.27,37.72
SPI1_NSS  (via drill 0.35)
  Top 0.305: 46.5,26.75 46.88,26.38 49.37,26.38 U9.10
  Top 0.406: v78,36 74,36 73,37 47,37 44.5,34.5 44.5,28.75 46.5,26.75
  Bottom 0.406: JP28.1 92.88,37.88 85,30 84,30 v78,36
SPI1_SCK  (via drill 0.35)
  Top 0.305: U9.9 47.13,26.84 45.01,28.96 45.01,32.75 46.01,33.75 v46.25,33.75 | 71.11,23.29 71.52,23.7 71.52,30 71.04,30.48 | U13.9 69.81,23.29 69.82,23.29 69.83,23.29 71.11,23.29 | 71.04,30.48 | 71.04,30.48 v71.04,30.41 | v73.5,30.41 70.85,33.06 v70.26,33.06 | U14.9 76.05,13.29 75.24,12.48 75.24,10.8 v75.36,10.68 | v70.98,8.05 70.98,12.31 72.31,13.64 72.31,16.64 70.98,17.97 70.98,20.76 71.04,20.82 72,21.78 72,22.4 71.11,23.29
  Top 0.61: v19.81,4.88 19.81,8.84 v21.34,10.36 | v29.93,22.86 31.7,22.86 32.31,22.25 32.31,20 R46.1
  Bottom 0.305: v71.04,30.41 73.49,30.41 v73.5,30.42 v73.5,30.41 | v70.26,33.06 67.93,35.39 41.6,35.39 39.96,33.75 | v75.36,10.68 75.06,10.38 75.06,9.79 73.09,7.82 71.14,7.82 70.98,7.98 v70.98,8.05
  Bottom 0.61: JP29.1 19.95,4.74 v19.81,4.88 | v21.34,10.36 21.34,11.89 28.04,18.59 28.04,20.98 v29.93,22.86 29.93,28.93 34.75,33.75 39.96,33.75 v46.25,33.75
SPI_NSS2  (via drill 0.35)
  Top 0.305: v71.45,3.12 67.12,7.45 67.12,16.5 62.75,20.88 62.75,22.62 63.57,23.44 67.73,23.44 68.36,22.81 U13.10
  Bottom 0.305: JP32.1 87.44,2.6 86,1.17 73.41,1.17 v71.45,3.12
SPI_NSS3
  Top 0.305: U14.10 76.82,12.81 76.2,12.19 76.2,8.53 78.64,6.1 91.75,6.1 93.26,4.58 JP33.1
TO_ADC1  (via drill 0.35)
  Top 0.305: v98.75,29.92 98.63,29.8 98.63,24.71 U11.7
  Bottom 0.305: JP10.1 95.13,7.01 104.55,7.01 107.59,10.06 107.59,26.82 104.55,29.87 98.75,29.87 v98.75,29.92
TO_ADC2  (via drill 0.35)
  Top 0.406: v106.62,12.5 105.75,12.5 104.9,13.35 U12.7
  Bottom 0.61: JP11.1 22.49,4.37 24,5.88 92.62,5.88 95.5,8.75 103.88,8.75 106.62,11.5 v106.62,12.5
VCC_1.5V
  Top 0.406: U12.6 105.56,17.58 99.36,23.77 99.36,24.64 U11.6 99.31,27.68 100.28,28.65 106.68,28.65 108.2,30.18 108.2,33.22 107.14,34.29 106.36,34.29
  Top 0.508: U4.5 106.36,34.29 C48.1
VCC_2.5V  (via drill 0.35)
  Top 0.305: U3.2 64.49,6.83 | U3.3 62.64,7.32 64.01,7.32 64.49,6.83 | 64.49,6.83 65.01,6.83 C8.1 65.61,6.17 66.52,5.26 v66.52,5.03 | U9.1 57.05,26.35 C17.1 | C18.1 76.42,22.81 U13.1 74.05,22.84 73.24,22.84 73.21,22.86 72.24,22.86 72.24,30.18 v70.64,31.77 | C20.1 84.09,12.23 83.52,12.8 81.83,12.8 U14.1 81.61,12.8 80.92,12.8 80.01,13.72 80.01,18.06 80.92,18.97 v81.38,18.97 | v81.61,20.8 80.92,21.49 C29.1 | v51.21,24.46 51.15,24.52 46.24,24.52 42.98,21.26 41.83,21.26 40.23,19.66 36.58,19.66 QG1.4 | v35.66,5.03 35.66,5.49 37.95,7.77 42.98,7.77 v46.36,11.15 | v61.04,25.15 60.35,25.83 C31.1 | R12.1 69.61,12.42 68.46,12.42 67.86,11.82 67.86,8.52 67.8,8.46 71.04,5.22 71.04,5.12 v71.12,5.04
  Top 0.406: C17.1 55.99,26 v54.5,24.5
  Top 0.61: QG1.4 36.47,17.3 C41.1
  Top 1.016: C17.1 60.01,26 C31.1 | C18.1 80.39,21.64 C29.1 | C20.1 84.14,10.65 C30.1 | R11.1 71.5,16.3 R12.1
  Bottom 0.305: v81.38,18.97 81.38,20.57 v81.61,20.8 | 52.87,26.13 v51.21,24.46 51.21,16.46 46.3,11.55 46.3,11.21 v46.36,11.15 | v35.66,5.03 v66.52,5.03 v71.11,5.03 v71.12,5.04 | v70.64,31.77 68.12,31.77 61.49,25.15 v61.04,25.15
  Bottom 0.406: v54.5,24.5 52.87,26.13 47.25,31.75 R10.1 | 46,31.75 R10.1 | R10.1 v46.13,31.73
VCC_3V  (via drill 0.35)
  Top 0.305: C5.1 3.93,27.74 4.27,27.74 4.58,28.05 | 4.58,28.05 U2.2 | 4.58,28.05 5.12,28.05 | 5.12,28.05 5.12,28.04 | 5.12,28.05 5.08,28.08 U2.3 | C25.2 16.54,15.02 18.37,16.84 U$1.15 22.84,16.84 | U$1.4 25.54,18.12 24.12,18.12 22.84,16.84 | 22.84,16.84 22.84,13.76 C24.1
  Top 1.016: C26.1 13.76,10.97 | 13.76,10.97 14.33,10.97 15.97,12.62 C25.2 | C5.1 2.66,23.39 v2.13,22.86 | v2.44,8.53 3.66,7.32 10.67,7.32 13.76,10.41 13.76,10.97
  Bottom 1.016: v2.13,22.86 1.52,22.25 1.52,9.45 v2.44,8.53
VCC_5V  (via drill 0.35)
  Top 0.254: v47.76,25.2 47.61,25.05 42.34,25.05 C2.1
  Top 0.305: U1.2 41.58,27.43 | 41.58,27.43 41.58,26.39 C2.1 | U1.3 42.08,27.75 41.76,27.43 41.58,27.43 | v58.29,14.4 60.12,12.57 60.12,11.66 U10.8 | U15.8 50.67,18.98 51.88,18.98 v52.12,18.75 52.12,20.05 49.37,22.8 v49.02,22.8 48.66,22.8 | v98.75,32 98.07,31.32 98.07,24.92 U11.8 | v96.47,33.6 96.47,34.98 97.11,35.61 106.81,35.61 108.81,33.6 108.81,15.77 v106.53,13.49 | v103.33,10.06 94.18,10.06 v93.04,11.2 | v83.67,24.23 83.67,25.6 v83.21,26.06 | v67.21,29.72 61.04,29.72 v59.66,28.35
  Top 0.406: U11.8 98.08,24.63 98.08,23.29 98.94,23.29 104.27,17.96 U12.8
  Top 0.61: C34.1 41.32,26.07 C2.1
  Bottom 0.305: v52.12,18.75 56.46,14.4 v58.29,14.4 59.21,15.32 59.21,26.06 59.66,26.52 v59.66,28.35 | v98.75,32 98.07,32 v96.47,33.6 | v106.53,13.49 103.33,10.29 v103.33,10.06 | v93.04,11.2 91.21,11.2 83.67,18.75 v83.67,24.23 | v83.21,26.06 81.15,26.06 80.7,25.6 79.78,25.6 77.95,27.43 77.95,27.89 76.12,29.72 v67.21,29.72 | v49.02,22.8 48.95,22.88 48.95,23.56 47.76,24.74 v47.76,25.2
VCCS_DAC
  Top 1.016: JP12.1 99.19,2.6 R16.2
VCCS_OUT_I
  Top 0.305: R3.1 43.3,14.65 44.5,15.85 47.24,15.85 47.91,16.51 47.91,20.78 R2.1
  Top 0.61: JP7.1 25.03,4.61 29.26,8.84 42.37,8.84 43.3,9.77 R3.1
VEE_-2.5V  (via drill 0.35)
  Top 0.305: 75.91,27.43 75.91,26.24 76.05,26.1 76.05,24.8 75.58,24.33 74.1,24.33 U13.4 | U14.4 81.84,14.33 83.21,14.33 83.82,14.94 83.82,15.85 | 83.82,15.85 82.58,17.09 C21.2 | 83.82,15.85 84.47,16.5 85.27,16.5 | 85.27,16.5 C53.1 | U9.4 55.85,27.85 56.47,28.46 56.47,33.1 | v77.27,27.43 76.35,27.43 C19.2 | v80.24,24.69 80.24,24.32 | 53.03,33.1 53.03,35.43 53.26,35.66 63.32,35.66 64.01,34.98 64.69,34.98 U5.5 | v85.27,19.2 85.27,16.5 | v89.38,28.35 89.38,29.49 86.64,32.23 86.64,33.6 86.41,33.83 84.81,33.83 84.12,33.15 84.12,32.46 81.61,29.95 80.24,29.95 79.32,29.03 75.91,29.03 | 85.27,16.46 85.27,16.5
  Top 0.508: U5.5 67.81,34.94 C14.1
  Top 1.016: C49.1 56.47,33.1 C40.1 53.03,33.1 51.39,33.1 50.39,32.1 C16.2 | C14.1 73.98,34.52 75.91,32.6 75.91,29.03 C19.2 75.91,27.43 | C50.1 80.24,24.32 C51.1 | C53.1 C52.1
  Bottom 0.305: v80.24,24.69 79.78,25.15 79.55,25.15 v77.27,27.43 | v85.27,19.2 85.27,24.23 v89.38,28.35
VEE_-5V  (via drill 0.35)
  Top 0.305: v53.26,10.92 55,12.66 55.09,12.57 | 55.09,12.57 58.29,15.77 U10.4 | v47.84,10.8 47.43,10.8 | v58.98,8.69 55.09,12.57 | v75.44,5.03 v71.82,8.65 | v75.89,6.86 v77.72,5.03 | v93.04,7.54 93.5,7.54 94.41,6.63 104.7,6.63 v105.39,5.94 | 106.07,26.52 v107.9,28.35
  Top 0.406: U11.5 99.97,24.72 99.97,26.82 100.58,27.43 105.16,27.43 106.07,26.52 106.19,26.39 U12.5
  Top 0.508: U8.5 46.2,5.16 C12.1 | U15.4 46.68,15.2 47.43,14.45 C33.1
  Top 1.016: C33.1 47.43,10.8 47.43,6.15 C12.1
  Bottom 0.305: v53.26,10.92 53.14,10.8 v47.84,10.8 | v77.72,5.03 v75.44,5.03 | v75.89,6.86 91.67,6.86 91.9,6.63 92.35,6.63 93.04,7.32 v93.04,7.54 | v105.39,5.94 105.39,6.4 108.81,9.83 108.81,27.43 v107.9,28.35 | v58.98,8.69 59.47,8.69 59.76,8.4 61.62,8.4 62.05,8.83 71.64,8.83 v71.82,8.65
(copper drawn outside any net)
  shapes: Top area x2